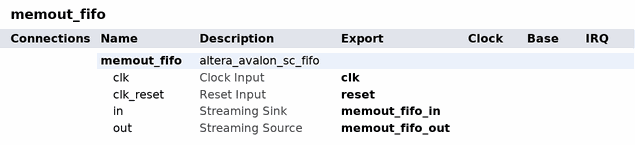
[diagram p0: system contents]
# Platform Designer (Qsys) system memout_fifo, Stratix V 5SGXEA7N2F45C2
# Parameters at their usual value, and those the tool derives, are not listed.
package require -exact qsys 16.1
create_system memout_fifo
set_project_property DEVICE_FAMILY {Stratix V}
set_project_property DEVICE 5SGXEA7N2F45C2

add_instance memout_fifo altera_avalon_sc_fifo 16.1
set_instance_parameter_value memout_fifo BITS_PER_SYMBOL 8
set_instance_parameter_value memout_fifo CHANNEL_WIDTH 0
set_instance_parameter_value memout_fifo ERROR_WIDTH 0
set_instance_parameter_value memout_fifo FIFO_DEPTH 4
set_instance_parameter_value memout_fifo SYMBOLS_PER_BEAT 8
set_instance_parameter_value memout_fifo USE_FILL_LEVEL 0
set_instance_parameter_value memout_fifo USE_MEMORY_BLOCKS 1
set_instance_parameter_value memout_fifo USE_PACKETS 1
set_instance_parameter_value memout_fifo USE_STORE_FORWARD 0

# exported interfaces
add_interface clk clock sink
set_interface_property clk EXPORT_OF memout_fifo.clk
add_interface memout_fifo_in avalon_streaming sink
set_interface_property memout_fifo_in EXPORT_OF memout_fifo.in
add_interface memout_fifo_out avalon_streaming source
set_interface_property memout_fifo_out EXPORT_OF memout_fifo.out
add_interface reset reset sink
set_interface_property reset EXPORT_OF memout_fifo.clk_reset

set_interconnect_requirement {$system} qsys_mm.clockCrossingAdapter HANDSHAKE
set_interconnect_requirement {$system} qsys_mm.enableEccProtection FALSE
set_interconnect_requirement {$system} qsys_mm.insertDefaultSlave FALSE
set_interconnect_requirement {$system} qsys_mm.maxAdditionalLatency 1

save_system memout_fifo.qsys
